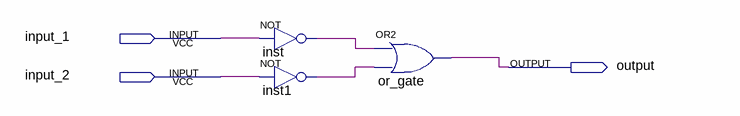
[diagram p0: schematic sheet]
// Quartus schematic lab2.bdf as structural Verilog: 3 symbols, 3 pins
module lab2 (
  input  input_1,
  input  input_2,
  output \output 
);

  wire inst1_out, inst_out;

  not inst (inst_out, input_1);
  not inst1 (inst1_out, input_2);
  or or_gate (\output , inst_out, inst1_out);
endmodule
